# EAGLE design board_before auto router (EAGLE 5.01)

## Sheet 1 of 2
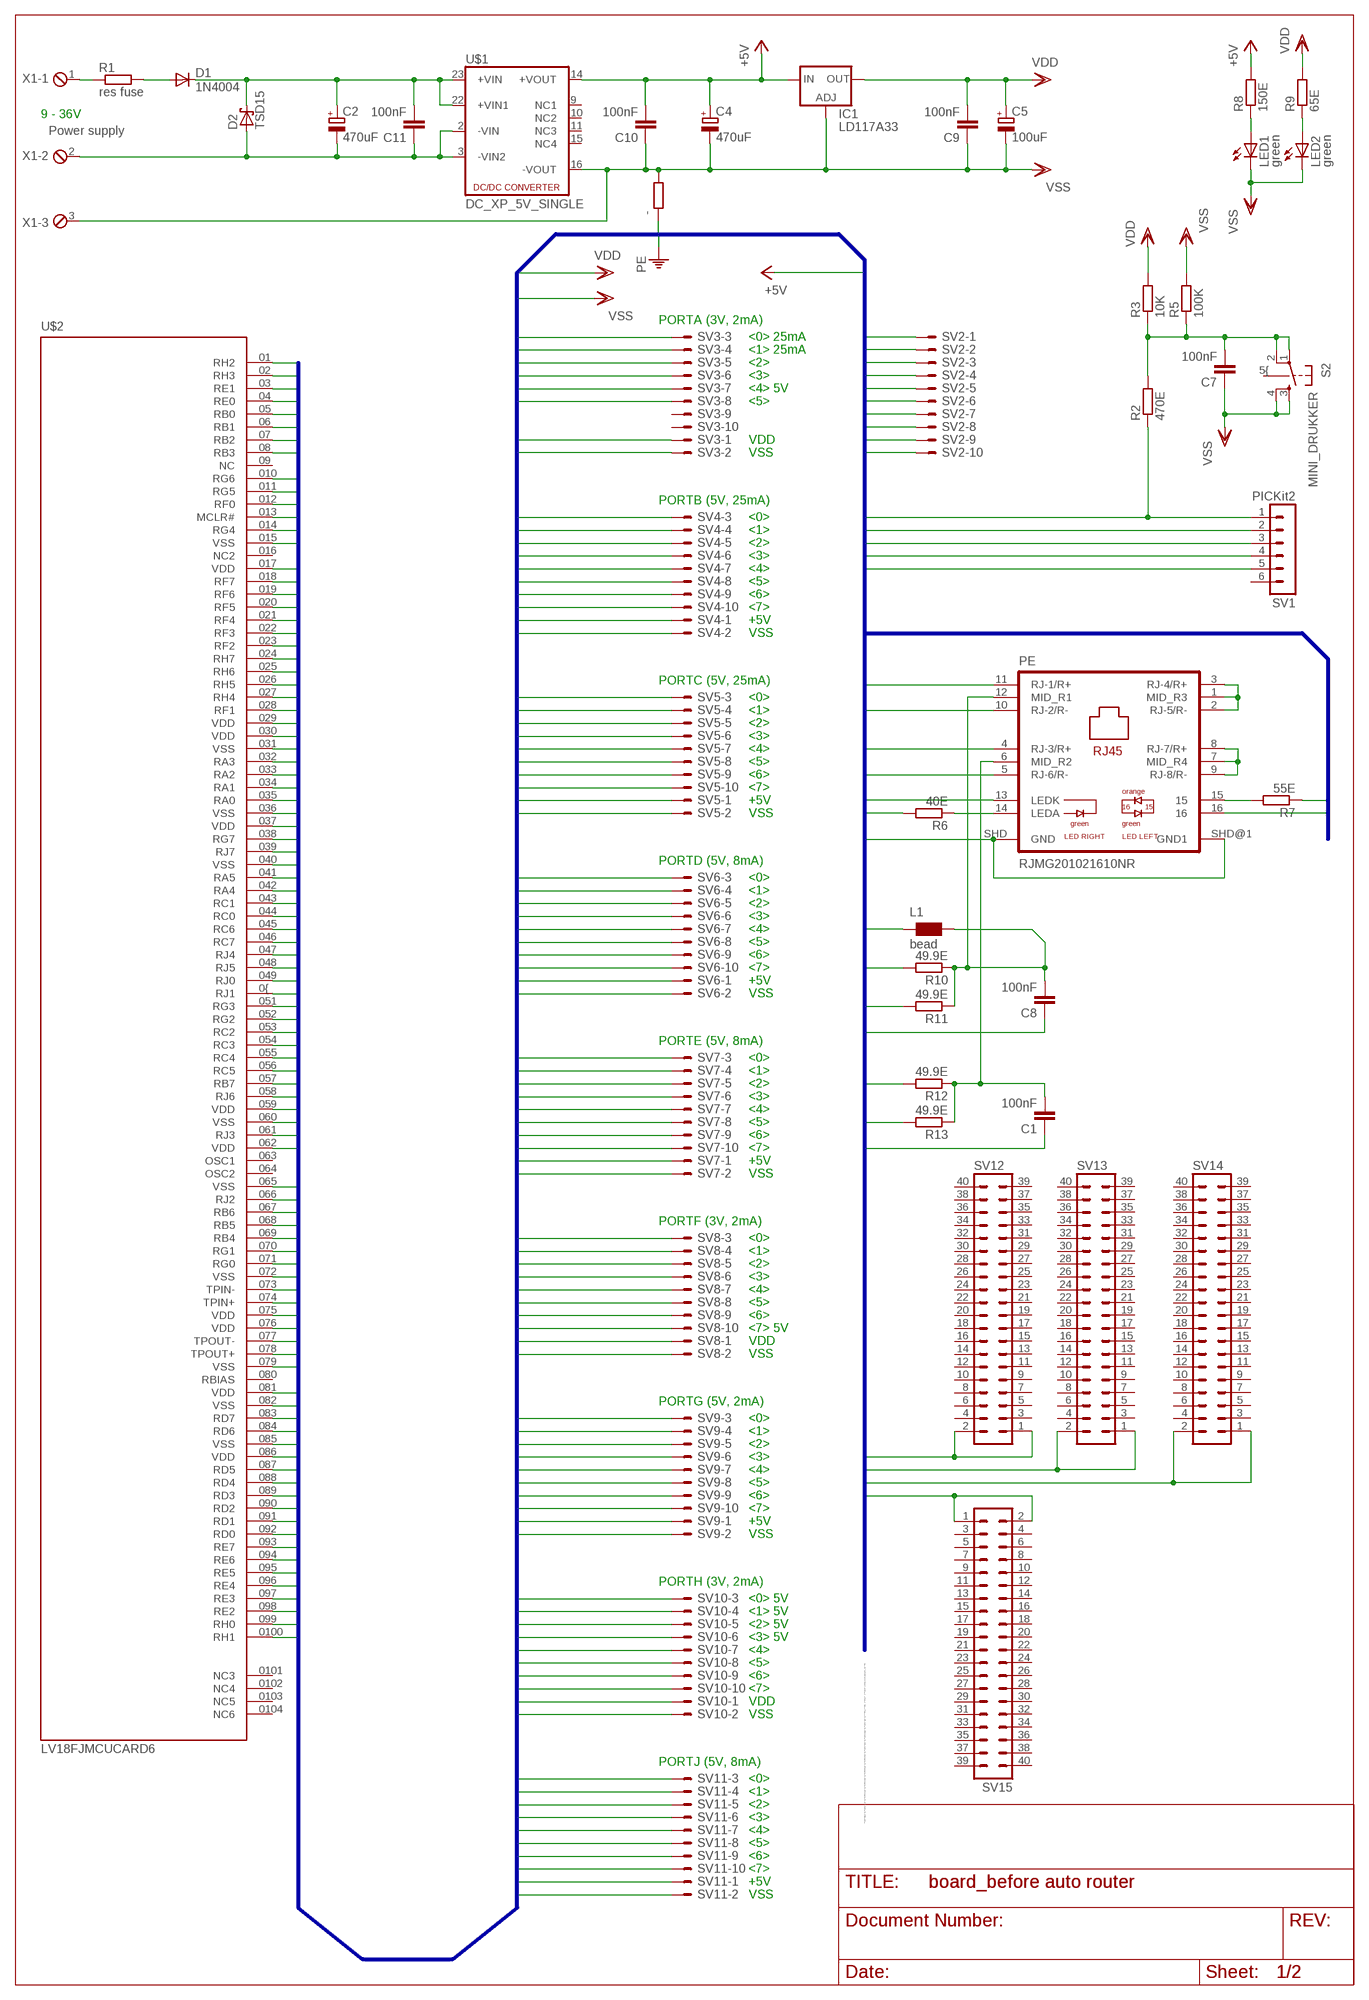
[diagram p0: schematic, sheet 1]

### Parts
-  R-EU_0204/2V  [0204V]
C1  100nF  C-EU050-025X075  [C050-025X075]
C2  470uF  CPOL-EUE5-8.5  [E5-8,5]
C4  470uF  CPOL-EUE5-8.5  [E5-8,5]
C5  100uF  CPOL-EUE5-8.5  [E5-8,5]
C7  100nF  C-EU050-025X075  [C050-025X075]
C8  100nF  C-EU050-025X075  [C050-025X075]
C9  100nF  C-EU050-025X075  [C050-025X075]
C10  100nF  C-EU050-025X075  [C050-025X075]
C11  100nF  C-EU050-025X075  [C050-025X075]
D1  1N4004  [DO41-10]
D2  TSD15  [CB429-15]
IC1  LD117A33  [TO220L1_2]
L1  bead  WE-MI_1206  [1206]
LED1  green  LED3MM  [LED3MM]
LED2  green  LED3MM  [LED3MM]
PE  RJMG201021610NR  [RJMG20102XX10XX]
R1  res fuse  R-EU_0207/7  [0207/7]
R2  470E  R-EU_0207/10  [0207/10]
R3  10K  R-EU_0207/10  [0207/10]
R5  100K  R-EU_0207/10  [0207/10]
R6  40E  R-EU_0207/10  [0207/10]
R7  55E  R-EU_0207/10  [0207/10]
R8  150E  R-EU_0207/10  [0207/10]
R9  65E  R-EU_0207/10  [0207/10]
R10  49.9E  R-EU_0207/10  [0207/10]
R11  49.9E  R-EU_0207/10  [0207/10]
R12  49.9E  R-EU_0207/10  [0207/10]
R13  49.9E  R-EU_0207/10  [0207/10]
S2  MINI_DRUKKER  [MINI_DRUKKER]
SV1  PICKit2  MA06-1  [MA06-1]
SV2  ML10E  [ML10]
SV3  ML10E  [ML10]
SV4  ML10E  [ML10]
SV5  ML10E  [ML10]
SV6  ML10E  [ML10]
SV7  ML10E  [ML10]
SV8  ML10E  [ML10]
SV9  ML10E  [ML10]
SV10  ML10E  [ML10]
SV11  ML10E  [ML10]
SV12  MA20-2  [MA20-2]
SV13  MA20-2  [MA20-2]
SV14  MA20-2  [MA20-2]
SV15  MA20-2  [MA20-2]
U$1  DC_XP_5V_SINGLE  [XP_24P_DIP_5V_SINGLE]
U$2  LV18FJMCUCARD6  [LV18FJMCUCARD6]
X1  Power supply  MPT3  [3POL254]

### Nets
+5V [Power 5V +]: C4.+ C10.2 IC1.3(IN) R8.2 SV2.1 SV2.3 SV2.5 SV4.1 SV5.1 SV6.1 SV7.1 SV9.1 SV11.1 SV14.1 SV14.2 U$1.14(+VOUT)
MCLR: R2.1 SV1.1 U$2.013(MCLR#)
N$1 [High Voltage +]: D1.A R1.2
N$2: PE.1(MID_R3) PE.2(RJ-5/R-) PE.3(RJ-4/R+)
N$3 [High Voltage +]: R1.1 X1.1
N$4 [High Voltage +]: C2.+ C11.2 D1.C D2.C U$1.22(+VIN1) U$1.23(+VIN)
N$5: C7.2 R2.2 R3.1 R5.1 S2.1(P) S2.2(P1)
N$6: PE.7(MID_R4) PE.8(RJ-7/R+) PE.9(RJ-8/R-)
N$7 [High Voltage -]: C2.- C11.1 D2.A U$1.2(-VIN) U$1.3(-VIN2) X1.2
N$8: PE.14(LEDA) R6.1
N$9: PE.15 R7.2
N$12: LED1.A R8.1
N$13: LED2.A R9.1
N$14: C8.2 L1.2 PE.12(MID_R1) R10.1 R11.1
N$15: C1.2 PE.6(MID_R2) R12.1 R13.1
PE [High Voltage -]: -.1 C1.1 C8.1 PE.SHD(GND) PE.SHD@1(GND1)
PORTA0: R6.2 SV3.3 U$2.035(RA0)
PORTA1: R7.1 SV3.4 U$2.034(RA1)
PORTA2: SV3.5 U$2.033(RA2)
PORTA3: SV3.6 U$2.032(RA3)
PORTA4: SV3.7 U$2.042(RA4)
PORTA5: SV3.8 U$2.041(RA5)
PORTB0: SV4.3 U$2.05(RB0)
PORTB1: SV4.4 U$2.06(RB1)
PORTB2: SV4.5 U$2.07(RB2)
PORTB3: SV4.6 U$2.08(RB3)
PORTB4: SV4.7 U$2.069(RB4)
PORTB5: SV4.8 U$2.068(RB5)
PORTB6: SV1.5 SV4.9 U$2.067(RB6)
PORTB7: SV1.4 SV4.10 U$2.057(RB7)
PORTC0: SV5.3 U$2.044(RC0)
PORTC1: SV5.4 U$2.043(RC1)
PORTC2: SV5.5 U$2.053(RC2)
PORTC3: SV5.6 U$2.054(RC3)
PORTC4: SV5.7 U$2.055(RC4)
PORTC5: SV5.8 U$2.056(RC5)
PORTC6: SV5.9 U$2.045(RC6)
PORTC7: SV5.10 U$2.046(RC7)
PORTD0: SV6.3 U$2.092(RD0)
PORTD1: SV6.4 U$2.091(RD1)
PORTD2: SV6.5 U$2.090(RD2)
PORTD3: SV6.6 U$2.089(RD3)
PORTD4: SV6.7 U$2.088(RD4)
PORTD5: SV6.8 U$2.087(RD5)
PORTD6: SV6.9 U$2.084(RD6)
PORTD7: SV6.10 U$2.083(RD7)
PORTE0: SV7.3 U$2.04(RE0)
PORTE1: SV7.4 U$2.03(RE1)
PORTE2: SV7.5 U$2.098(RE2)
PORTE3: SV7.6 U$2.097(RE3)
PORTE4: SV7.7 U$2.096(RE4)
PORTE5: SV7.8 U$2.095(RE5)
PORTE6: SV7.9 U$2.094(RE6)
PORTE7: SV7.10 U$2.093(RE7)
PORTF0: SV8.3 U$2.012(RF0)
PORTF1: SV8.4 U$2.028(RF1)
PORTF2: SV8.5 U$2.023(RF2)
PORTF3: SV8.6 U$2.022(RF3)
PORTF4: SV8.7 U$2.021(RF4)
PORTF5: SV8.8 U$2.020(RF5)
PORTF6: SV8.9 U$2.019(RF6)
PORTF7: SV8.10 U$2.018(RF7)
PORTG0: SV9.3 U$2.071(RG0)
PORTG1: SV9.4 U$2.070(RG1)
PORTG2: SV9.5 U$2.052(RG2)
PORTG3: SV9.6 U$2.051(RG3)
PORTG4: SV9.7 U$2.014(RG4)
PORTG5: SV9.8 U$2.011(RG5)
PORTG6: SV9.9 U$2.010(RG6)
PORTG7: SV9.10 U$2.038(RG7)
PORTH0: SV10.3 U$2.099(RH0)
PORTH1: SV10.4 U$2.0100(RH1)
PORTH2: SV10.5 U$2.01(RH2)
PORTH3: SV10.6 U$2.02(RH3)
PORTH4: SV10.7 U$2.027(RH4)
PORTH5: SV10.8 U$2.026(RH5)
PORTH6: SV10.9 U$2.025(RH6)
PORTH7: SV10.10 U$2.024(RH7)
PORTJ0: SV11.3 U$2.049(RJ0)
PORTJ1: SV11.4 U$2.0{(RJ1)
PORTJ2: SV11.5 U$2.066(RJ2)
PORTJ3: SV11.6 U$2.061(RJ3)
PORTJ4: SV11.7 U$2.047(RJ4)
PORTJ5: SV11.8 U$2.048(RJ5)
PORTJ6: SV11.9 U$2.058(RJ6)
PORTJ7: SV11.10 U$2.039(RJ7)
TPIN+: PE.4(RJ-3/R+) R12.2 U$2.074(TPIN+)
TPIN-: PE.5(RJ-6/R-) R13.2 U$2.073(TPIN-)
TPOUT+: PE.11(RJ-1/R+) R10.2 U$2.078(TPOUT+)
TPOUT-: PE.10(RJ-2/R-) R11.2 U$2.077(TPOUT-)
VDD [Power 3V +]: C5.+ C9.2 IC1.2(OUT) L1.1 R3.2 R9.2 SV1.2 SV2.7 SV2.9 SV3.1 SV8.1 SV10.1 SV12.1 SV12.2 U$2.017(VDD) U$2.029(VDD) U$2.030(VDD) U$2.037(VDD) U$2.059(VDD) U$2.062(VDD) U$2.075(VDD) U$2.076(VDD) U$2.081(VDD) U$2.086(VDD)
VSS [Power 0V]: -.2 C4.- C5.- C7.1 C9.1 C10.1 IC1.1(ADJ) LED1.K(C) LED2.K(C) PE.13(LEDK) PE.16 R5.2 S2.3(S) S2.4(S1) SV1.3 SV2.2 SV2.4 SV2.6 SV2.8 SV2.10 SV3.2 SV4.2 SV5.2 SV6.2 SV7.2 SV8.2 SV9.2 SV10.2 SV11.2 SV13.1 SV13.2 SV15.1 SV15.2 U$1.16(-VOUT) U$2.015(VSS) U$2.031(VSS) U$2.036(VSS) U$2.040(VSS) U$2.060(VSS) U$2.065(VSS) U$2.072(VSS) U$2.079(VSS) U$2.082(VSS) U$2.085(VSS) X1.3
Unconnected: S2.5{(SHLD) SV1.6 SV3.9 SV3.10 SV12.3 SV12.4 SV12.5 SV12.6 SV12.7 SV12.8 SV12.9 SV12.10 SV12.11 SV12.12 SV12.13 SV12.14 SV12.15 SV12.16 SV12.17 SV12.18 SV12.19 SV12.20 SV12.21 SV12.22 SV12.23 SV12.24 SV12.25 SV12.26 SV12.27 SV12.28 SV12.29 SV12.30 SV12.31 SV12.32 SV12.33 SV12.34 SV12.35 SV12.36 SV12.37 SV12.38 SV12.39 SV12.40 SV13.3 SV13.4 SV13.5 SV13.6 SV13.7 SV13.8 SV13.9 SV13.10 SV13.11 SV13.12 SV13.13 SV13.14 SV13.15 SV13.16 SV13.17 SV13.18 SV13.19 SV13.20 SV13.21 SV13.22 SV13.23 SV13.24 SV13.25 SV13.26 SV13.27 SV13.28 SV13.29 SV13.30 SV13.31 SV13.32 SV13.33 SV13.34 SV13.35 SV13.36 SV13.37 SV13.38 SV13.39 SV13.40 SV14.3 SV14.4 SV14.5 SV14.6 SV14.7 SV14.8 SV14.9 SV14.10 SV14.11 SV14.12 SV14.13 SV14.14 SV14.15 SV14.16 SV14.17 SV14.18 SV14.19 SV14.20 SV14.21 SV14.22 SV14.23 SV14.24 SV14.25 SV14.26 SV14.27 SV14.28 SV14.29 SV14.30 SV14.31 SV14.32 SV14.33 SV14.34 SV14.35 SV14.36 SV14.37 SV14.38 SV14.39 SV14.40 SV15.3 SV15.4 SV15.5 SV15.6 SV15.7 SV15.8 SV15.9 SV15.10 SV15.11 SV15.12 SV15.13 SV15.14 SV15.15 SV15.16 SV15.17 SV15.18 SV15.19 SV15.20 SV15.21 SV15.22 SV15.23 SV15.24 SV15.25 SV15.26 SV15.27 SV15.28 SV15.29 SV15.30 SV15.31 SV15.32 SV15.33 SV15.34 SV15.35 SV15.36 SV15.37 SV15.38 SV15.39 SV15.40 U$1.9(NC1) U$1.10(NC2) U$1.11(NC3) U$1.15(NC4) U$2.09(NC) U$2.016(NC2) U$2.063(OSC1) U$2.064(OSC2) U$2.080(RBIAS) U$2.0101(NC3) U$2.0102(NC4) U$2.0103(NC5) U$2.0104(NC6)

### Buses
PORTA[0..7],PORTB[0..7],PORTC[0..7],PORTD[0..7],PORTE[0..7],PORTF[0..7],PORTG[0..7],PORTH[0..7],PORTJ[0..7],TPIN+,TPIN-,TPOUT-,TPOUT+,VDD,VSS,MCLR,+5V,PE

### Notes on the sheet
- 9 - 36V
- PORTA (3V, 2mA)
- <0> 25mA
- <1> 25mA
- <2>
- <3>
- <4> 5V
- <5>
- VDD
- VSS
- PORTB (5V, 25mA)
- <0>
- <1>
- <2>
- <3>
- <4>
- <5>
- <6>
- <7>
- +5V
- VSS
- PORTC (5V, 25mA)
- <0>
- <1>
- <2>
- <3>
- <4>
- <5>
- <6>
- <7>
- +5V
- VSS
- PORTD (5V, 8mA)
- <0>
- <1>
- <2>
- <3>
- <4>
- <5>
- <6>
- <7>
- +5V
- VSS
- PORTE (5V, 8mA)
- <0>
- <1>
- <2>
- <3>
- <4>
- <5>
- <6>
- <7>
- +5V
- VSS
- PORTF (3V, 2mA)
- <0>
- <1>
- <2>
- <3>
- <4>
- <5>
- <6>
- <7> 5V
- VDD
- VSS
- PORTG (5V, 2mA)
- <0>
- <1>
- <2>
- <3>
- <4>
- <5>
- <6>
- <7>
- +5V
- VSS
- PORTH (3V, 2mA)
- <0> 5V
- <1> 5V
- <2> 5V
- <3> 5V
- <4>
- <5>
- <6>
- <7>
- VDD
- VSS
- PORTJ (5V, 8mA)
- <0>
- <1>
- <2>
- <3>
- <4>
- <5>
- <6>
- <7>
- +5V
- VSS

## Sheet 2 of 2
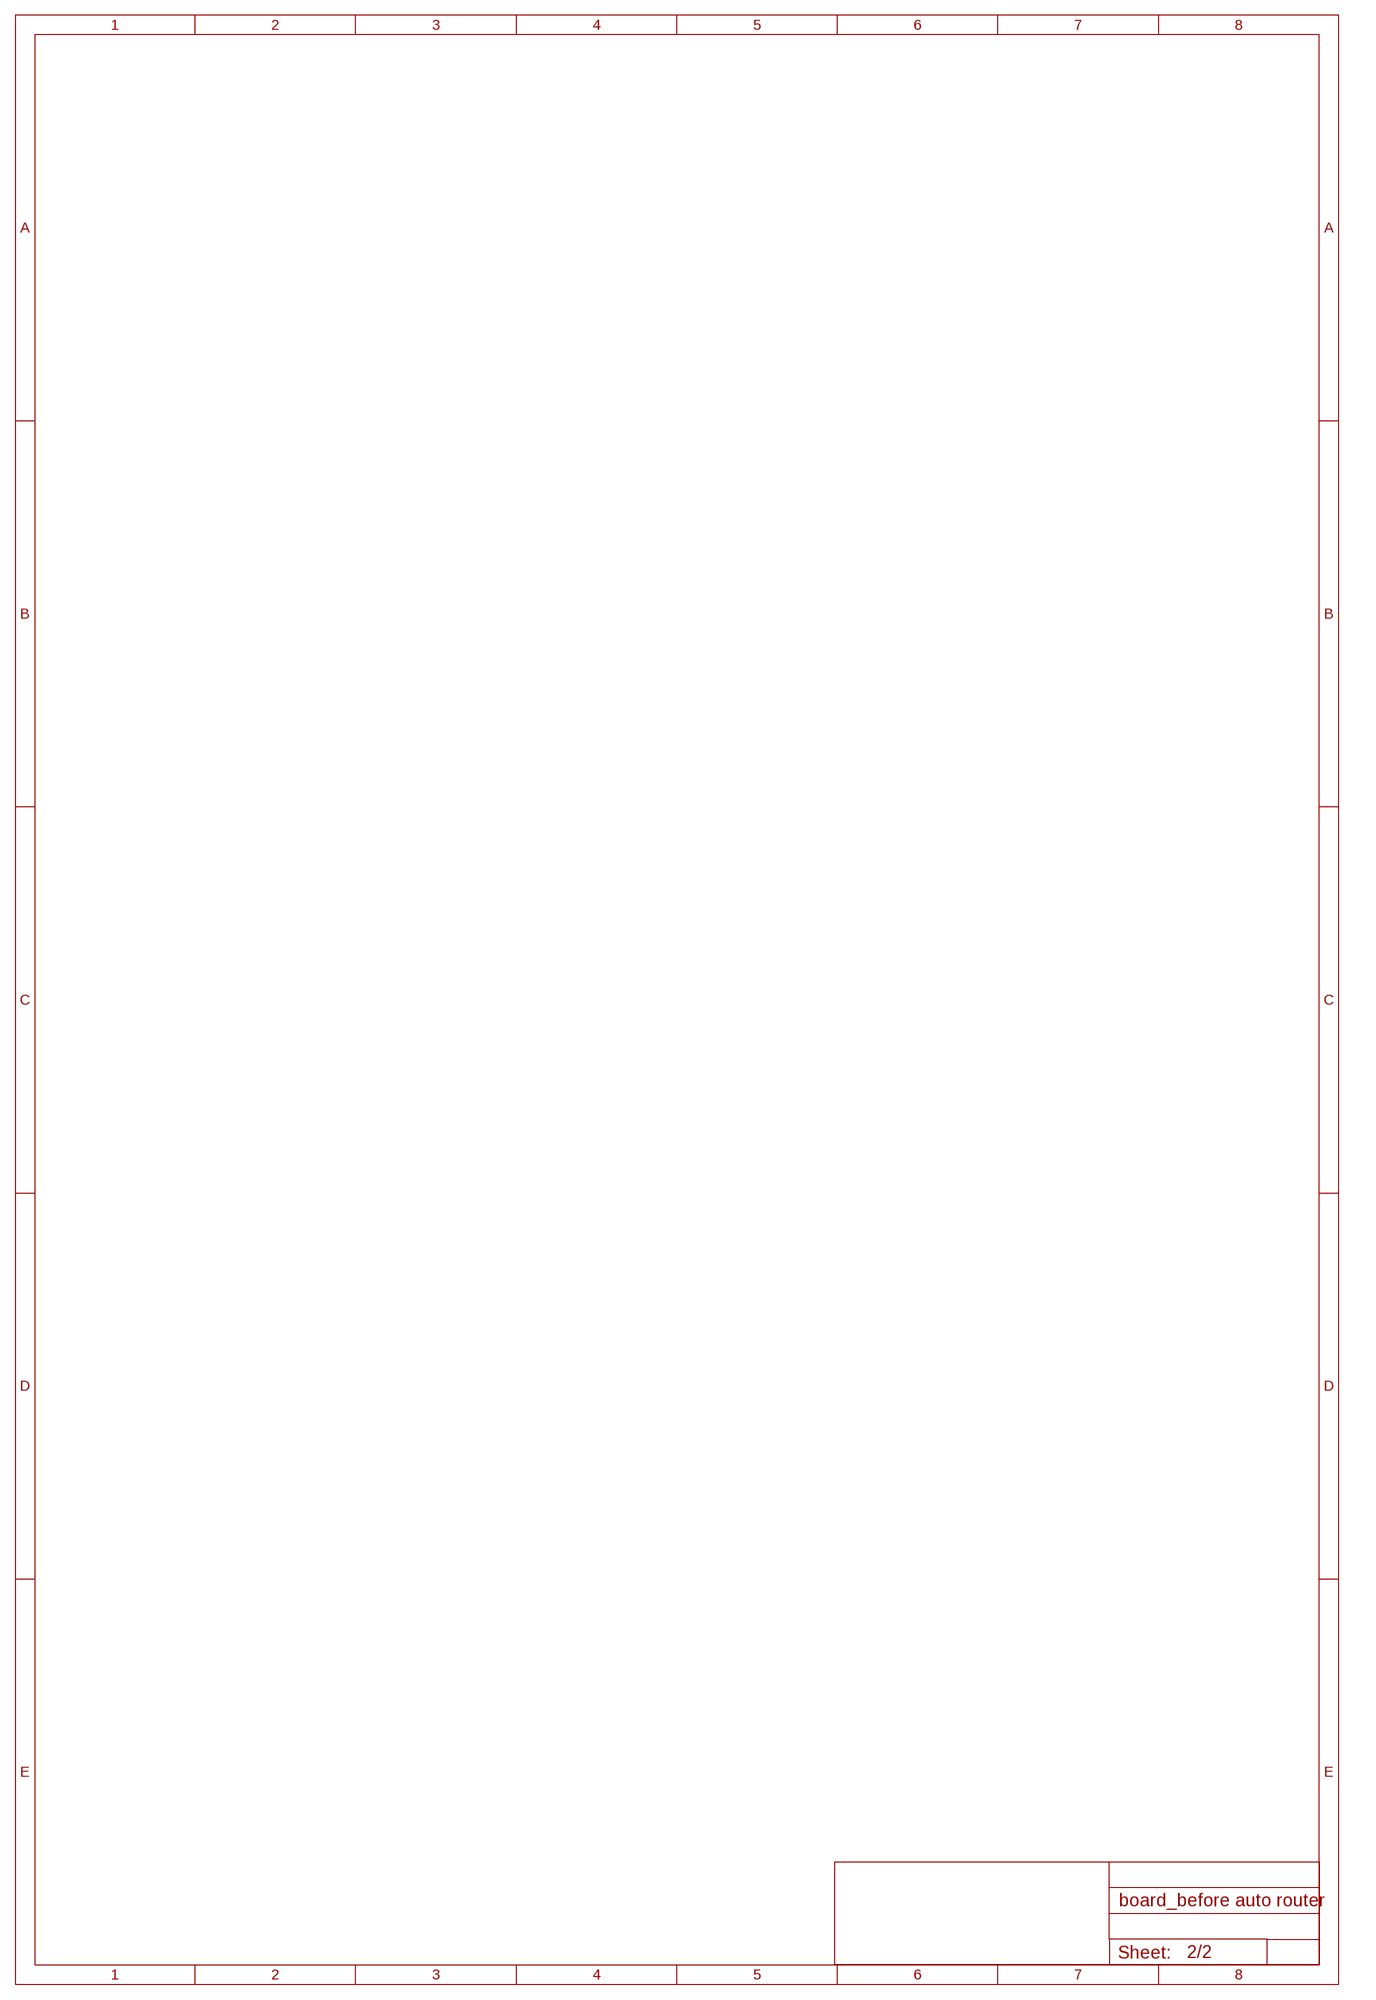
[diagram p1: schematic, sheet 2]

## Library data of the parts
- R1-R3 R5-R13 = rcl:R-EU_: RESISTOR, European symbol
C1 C7-C11 = rcl:C-EU: CAPACITOR, European symbol
C2 C4 C5 = rcl:CPOL-EU: POLARIZED CAPACITOR, European symbol
D1 = diode:1N4004: DIODE general purpose rectifier, 1 A
D2 = diode:TSD15: DIODE
IC1 = v-reg:LD117A?*: Low drop fixed and adjustable positive voltage regulators 1 A Source: http://www.st.com/stonline/products/literature/ds/7194/ld1117axx.pdf
L1 = wuerth-elektronik:WE-MI: SMD Multilayer Inductor WE-MI - Excellent solderability and high heat resistance -- Filter switches -- Oscillators -- Adjustment networks -- Discretely built T- or Pi-Filter
LED1 LED2 = led:LED: LED OSRAM: - CHIPLED LG R971, LG N971, LY N971, LG Q971, LY Q971, LO R971, LY R971 LH N974, LH R974 LS Q976, LO Q976, LY Q976 LO Q996 - Hyper CHIPLED LW Q18S LB Q993, LB Q99A, LB R99A - SideLED LS A670, LO A670, LY A670, LG A670, LP A670 LB A673, LV A673, LT A673, LW A673 LH A674 LY A675 LS A676, LA A676, LO A676, LY A676, LW A676 LS A679, LY A679, LG A679 - Hyper Micro SIDELED® LS Y876, LA Y876, LO Y876, LY Y876 LT Y87S - SmartLED LW L88C, LW L88S LB L89C, LB L89S, LG L890 LS L89K, LO L89K, LY L89K LS L896, LA L896, LO L896, LY L896 - TOPLED LS T670, LO T670, LY T670, LG T670, LP T670 LSG T670, LSP T670, LSY T670, LOP T670, LYG T670 LG T671, LOG T671, LSG T671 LB T673, LV T673, LT T673, LW T673 LH T674 LS T676, LA T676, LO T676, LY T676, LB T676, LH T676, LSB T676, LW T676 LB T67C, LV T67C, LT T67C, LS T67K, LO T67K, LY T67K, LW E67C LS E67B, LA E67B, LO E67B, LY E67B, LB E67C, LV E67C, LT E67C LW T67C LS T679, LY T679, LG T679 LS T770, LO T770, LY T770, LG T770, LP T770 LB T773, LV T773, LT T773, LW T773 LH T774 LS E675, LA E675, LY E675, LS T675 LS T776, LA T776, LO T776, LY T776, LB T776 LHGB T686 LT T68C, LB T68C - Hyper Mini TOPLED® LB M676 - Mini TOPLED Santana® LG M470 LS M47K, LO M47K, LY M47K Source: http://www.osram.convergy.de LUXEON: - LUMILED® LXK2-PW12-R00, LXK2-PW12-S00, LXK2-PW14-U00, LXK2-PW14-V00 LXK2-PM12-R00, LXK2-PM12-S00, LXK2-PM14-U00 LXK2-PE12-Q00, LXK2-PE12-R00, LXK2-PE12-S00, LXK2-PE14-T00, LXK2-PE14-U00 LXK2-PB12-K00, LXK2-PB12-L00, LXK2-PB12-M00, LXK2-PB14-N00, LXK2-PB14-P00, LXK2-PB14-Q00 LXK2-PR12-L00, LXK2-PR12-M00, LXK2-PR14-Q00, LXK2-PR14-R00 LXK2-PD12-Q00, LXK2-PD12-R00, LXK2-PD12-S00 LXK2-PH12-R00, LXK2-PH12-S00 LXK2-PL12-P00, LXK2-PL12-Q00, LXK2-PL12-R00 Source: www.luxeon.com KINGBRIGHT: KA-3528ASYC Source: www.kingbright.com
PE = Custom components:RJMG201021610NR
S2 = Custom components:MINI_DRUKKER
SV1 = con-lstb:MA06-1: PIN HEADER
SV2-SV11 = con-ml:ML10E: HARTING
SV12-SV15 = con-lstb:MA20-2: PIN HEADER
U$1 = dc-dc-converter:DC_XP_5V_SINGLE
U$2 = Mikroe:LV18FJMCUCARD6
X1 = con-phoenix-254:MPT3: PHOENIX CONNECTOR

## Net classes
1 Power 5V +: width 0.762 mm, drill 0.381 mm, clearance 0.762 mm
2 High Voltage +: width 1.27 mm, drill 0.635 mm, clearance 1.27 mm
3 Digital: width 0.406 mm, drill 0.508 mm, clearance 0.406 mm
4 Power 0V: width 0.762 mm, drill 0.381 mm, clearance 0.762 mm
5 High Voltage -: width 1.27 mm, drill 0.635 mm, clearance 1.27 mm
6 Power 3V +: width 1.016 mm, drill 0.61 mm, clearance 0.61 mm

## Board
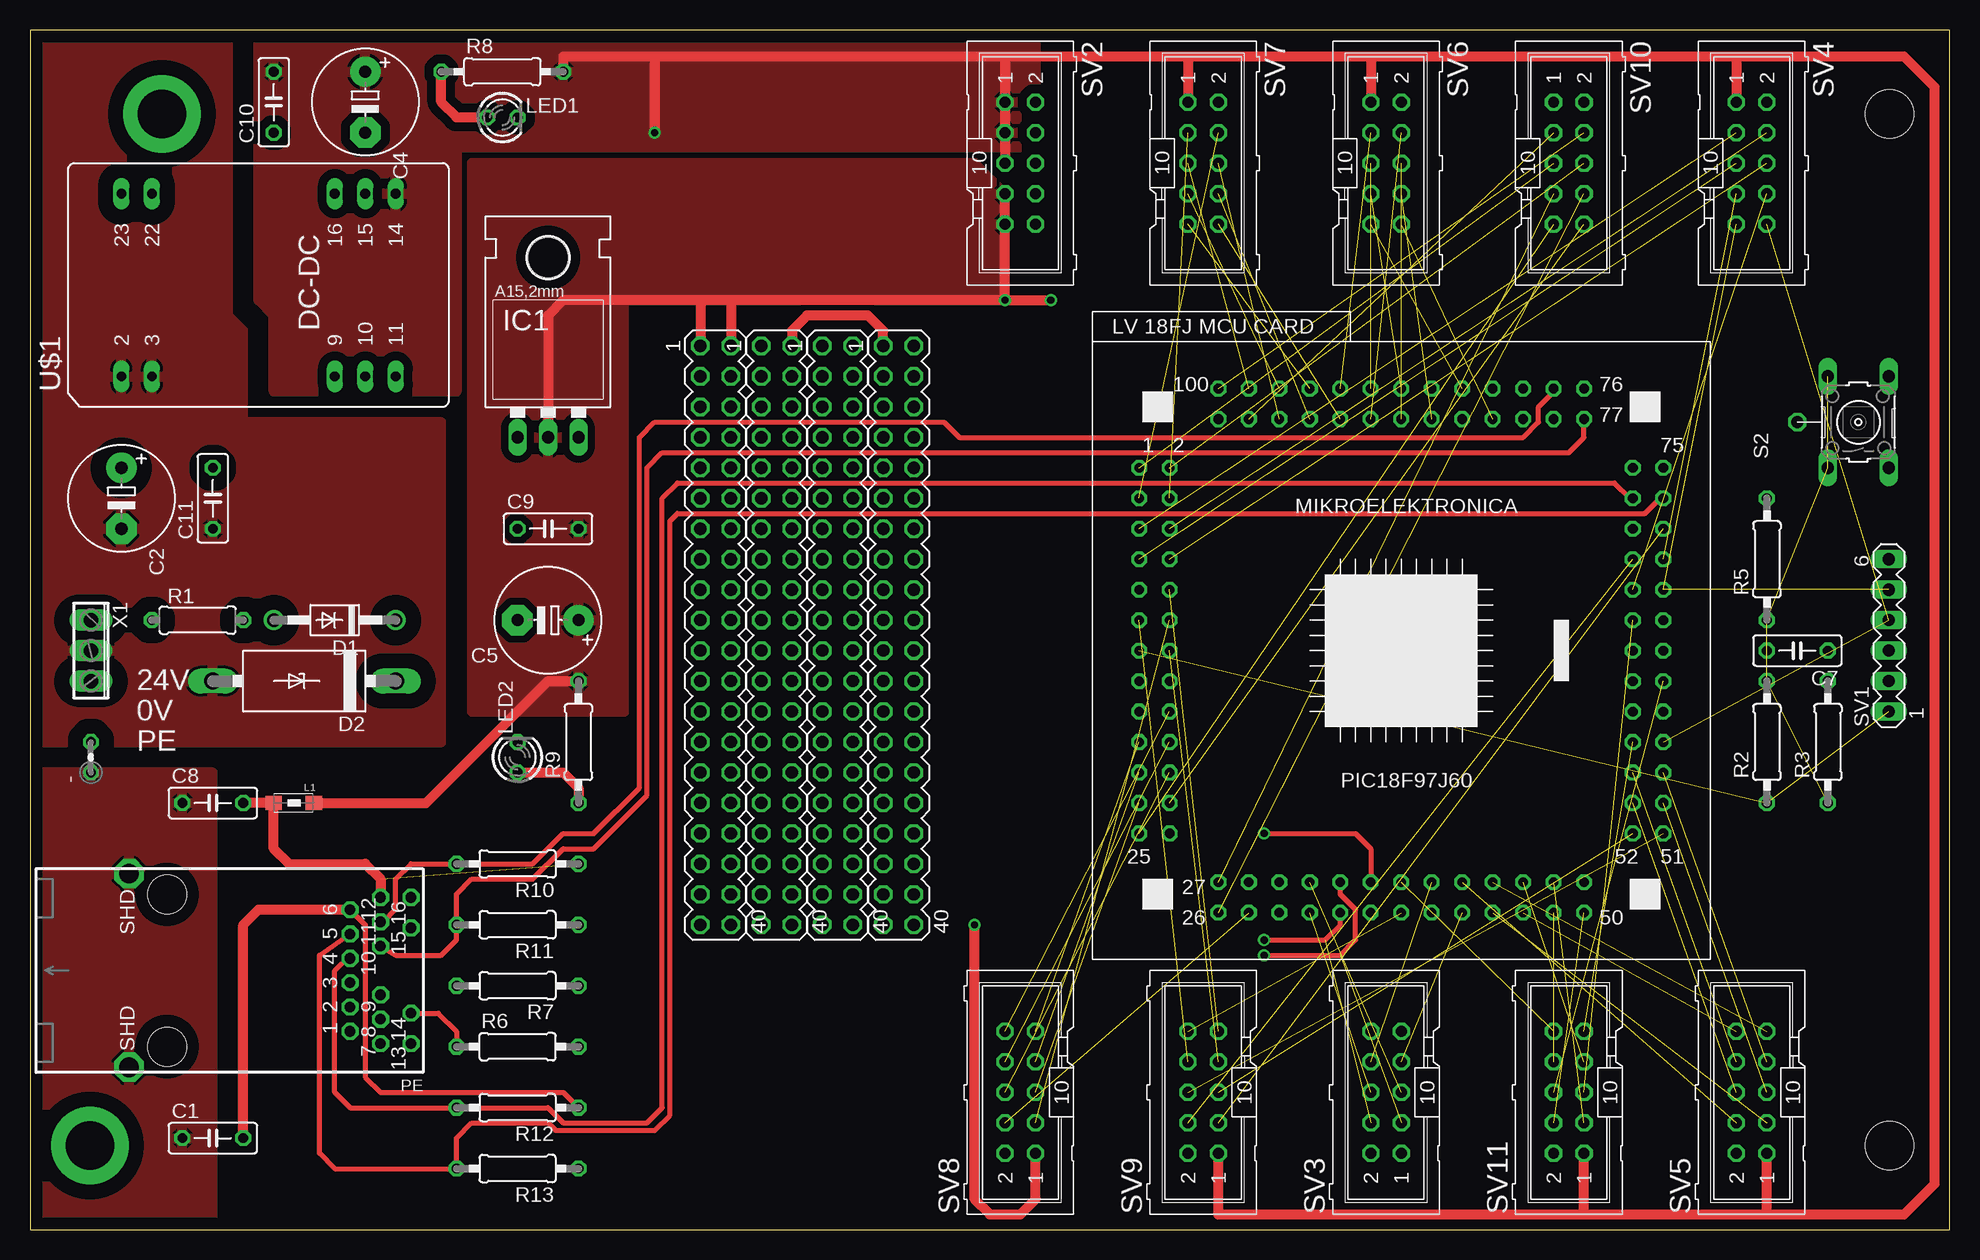
[diagram p2: board, top side]
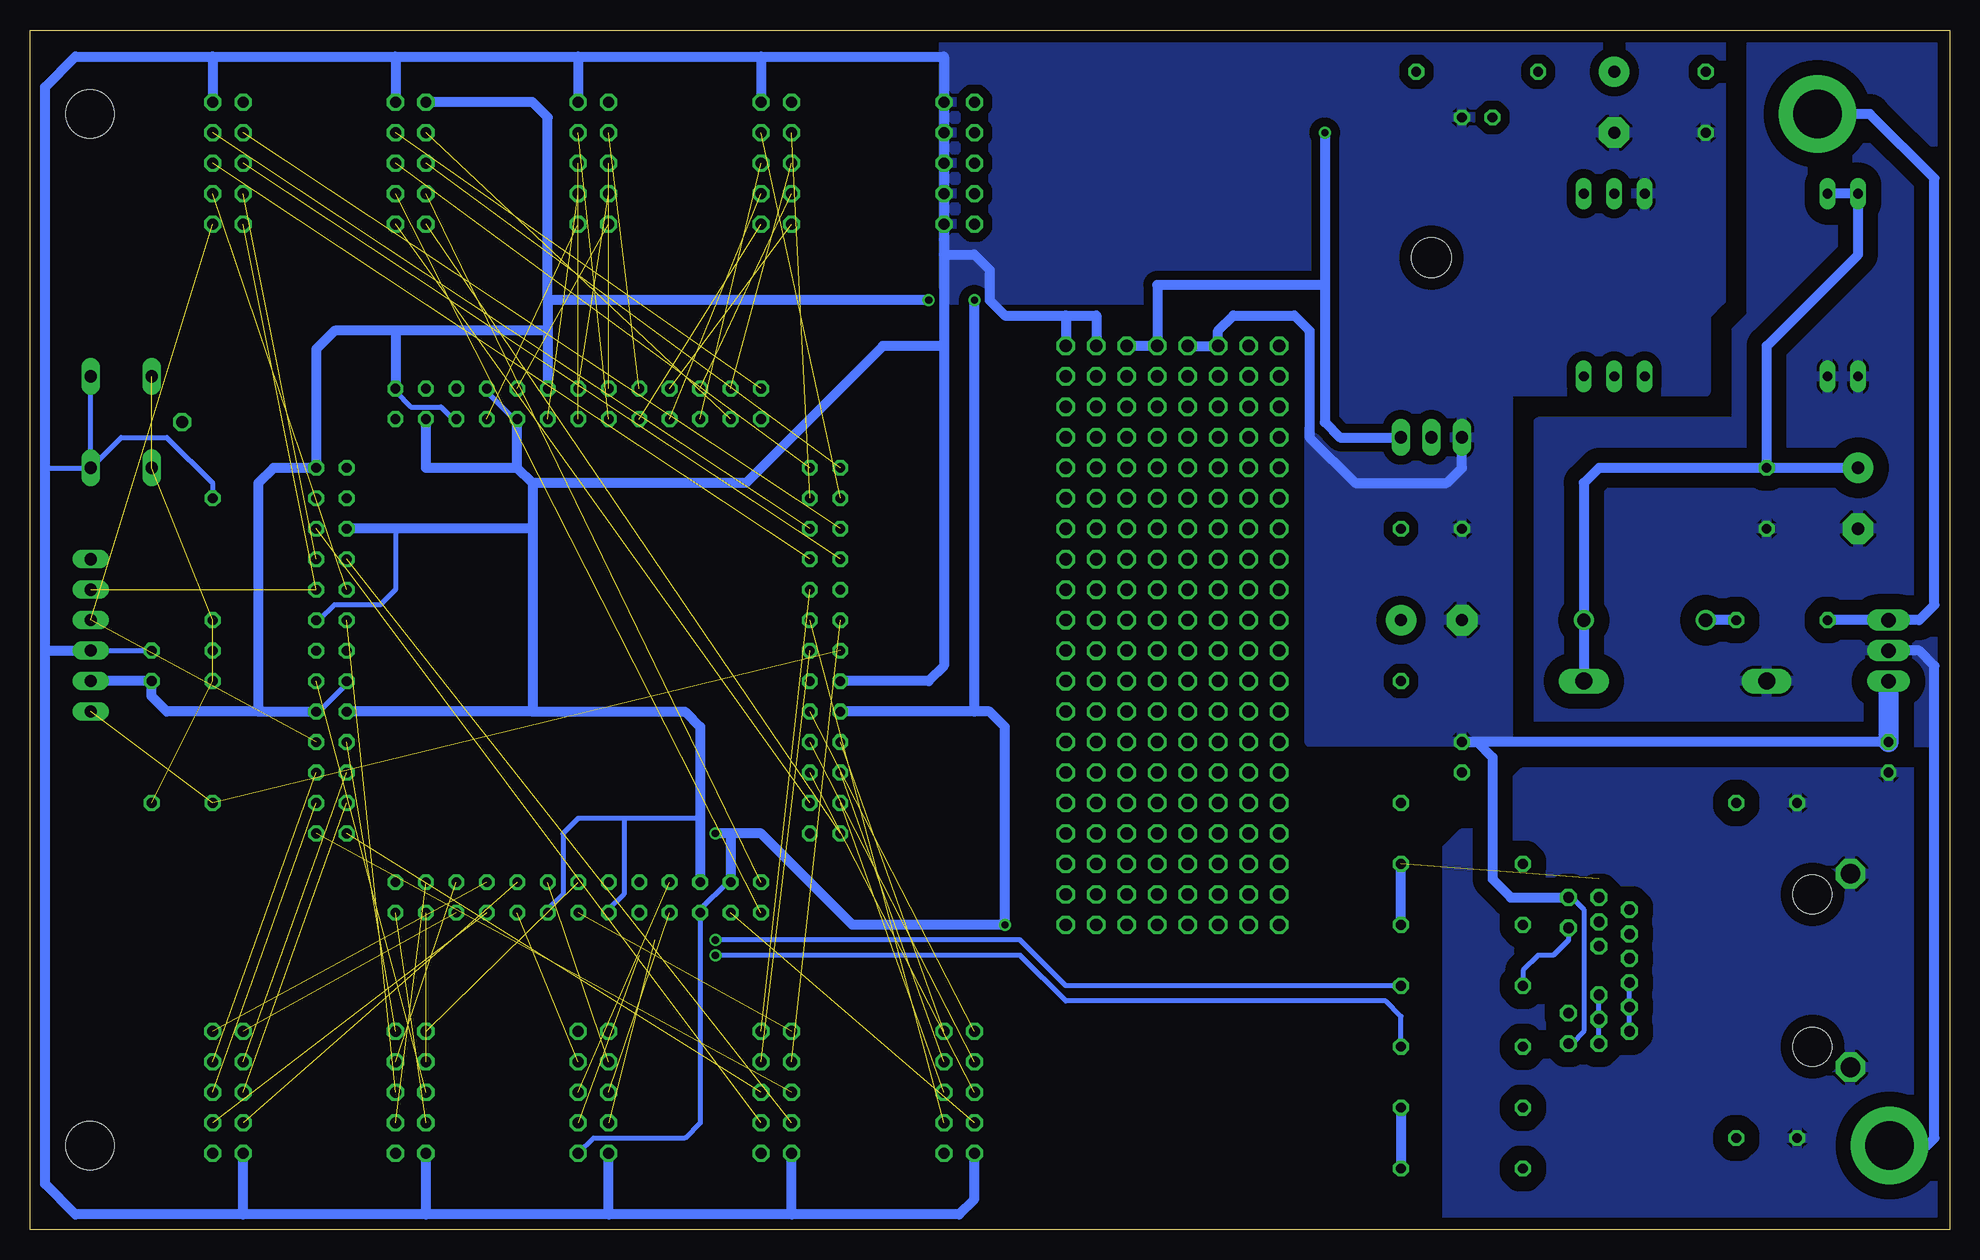
[diagram p3: board, bottom side, seen from below]

Size 160 x 100 mm. Coordinates in mm from the lower left corner, seen from the top.
Outline: 0,0 160,0 160,100 0,100 0,0
Copper layers (1*16): Top 0.035mm / dielectric 1.5mm / Bottom 0.035mm
Design rules "Make-PCB-Dual-Layer": minimum track width 8mil, minimum drill 12mil, track to track 8mil, track to pad 8mil, pad to pad 8mil, via to via 8mil, smd to smd 8mil, copper to edge 40mil, drill to drill 8mil, minimum pad ring 10mil, minimum via ring 8mil, stop-mask expansion 4mil, vias tented up to drill 0mil, thermal gap 10mil
Holes 4 mm at 155,7 155,93

### Footprints (pad centres in the part's own frame; a part is rotated, then mirrored left to right if it is on the bottom)
0204V = drill 0.813 octagon: 1 -1.27,0; 2 1.27,0
C050-025X075 = drill 0.813 octagon: 1 -2.54,0; 2 2.54,0
E5-8,5 = drill 1.016 pad 2.54 round: + -2.54,0 | drill 1.016 pad 2.54 octagon: - 2.54,0
DO41-10 = drill 1.118 round: A 5.08,0; C -5.08,0
CB429-15 = drill 1.397 long: A 7.62,0; C -7.62,0
TO220L1_2 = drill 1.016 long: 1 -2.54,-3.81; 2 0,-3.81; 3 2.54,-3.81 | hole 3.302: 0,11.176
1206 = smd 1.35 x 1.2: 1 -1.7,0; 2 1.65,0
LED3MM = drill 0.813 octagon: A -1.27,0; K 1.27,0
RJMG20102XX10XX = drill 0.89 octagon: 1 -5.075,-15.25; 2 -3.045,-15.25; 3 -1.015,-15.25; 4 1.015,-15.25; 5 3.045,-15.25; 6 5.075,-15.25; 7 -6.09,-17.79; 8 -4.06,-17.79; 9 -2.03,-17.79; 10 2.03,-17.79; 11 4.06,-17.79; 12 6.09,-17.79; 13 -6.09,-20.33; 14 -3.55,-20.33; 15 3.55,-20.33; 16 6.09,-20.33 | drill 1.64 octagon: SHD -8.065,3.17; SHD@1 8.065,3.17 | hole 3.25: -6.35,0; 6.35,0
0207/7 = drill 0.813 octagon: 1 -3.81,0; 2 3.81,0
0207/10 = drill 0.813 octagon: 1 -5.08,0; 2 5.08,0
MINI_DRUKKER = drill 1.016 long: 1 -3.81,2.54; 2 3.81,2.54; 3 -3.81,-2.54; 4 3.81,-2.54 | drill 1.016 octagon: 5{ 0,5.08
MA06-1 = drill 1.016 long: 1 -6.35,0; 2 -3.81,0; 3 -1.27,0; 4 1.27,0; 5 3.81,0; 6 6.35,0
ML10 = drill 0.914 octagon: 1 -5.08,-1.27; 2 -5.08,1.27; 3 -2.54,-1.27; 4 -2.54,1.27; 5 0,-1.27; 6 0,1.27; 7 2.54,-1.27; 8 2.54,1.27; 9 5.08,-1.27; 10 5.08,1.27
MA20-2 = drill 1.016 octagon: 1 -24.13,-1.27; 2 -24.13,1.27; 3 -21.59,-1.27; 4 -21.59,1.27; 5 -19.05,-1.27; 6 -19.05,1.27; 7 -16.51,-1.27; 8 -16.51,1.27; 9 -13.97,-1.27; 10 -13.97,1.27; 11 -11.43,-1.27; 12 -11.43,1.27; 13 -8.89,-1.27; 14 -8.89,1.27; 15 -6.35,-1.27; 16 -6.35,1.27; 17 -3.81,-1.27; 18 -3.81,1.27; 19 -1.27,-1.27; 20 -1.27,1.27; 21 1.27,-1.27; 22 1.27,1.27; 23 3.81,-1.27; 24 3.81,1.27; 25 6.35,-1.27; 26 6.35,1.27; 27 8.89,-1.27; 28 8.89,1.27; 29 11.43,-1.27; 30 11.43,1.27; 31 13.97,-1.27; 32 13.97,1.27; 33 16.51,-1.27; 34 16.51,1.27; 35 19.05,-1.27; 36 19.05,1.27; 37 21.59,-1.27; 38 21.59,1.27; 39 24.13,-1.27; 40 24.13,1.27
XP_24P_DIP_5V_SINGLE = drill 0.813 long: 2 -7.62,11.43; 3 -7.62,8.89; 9 -7.62,-6.35; 10 -7.62,-8.89; 11 -7.62,-11.43; 14 7.62,-11.43; 15 7.62,-8.89; 16 7.62,-6.35; 22 7.62,8.89; 23 7.62,11.43
LV18FJMCUCARD6 = drill 0.8 octagon: 0{ 15.24,-21.844; 01 -21.844,15.24; 02 -19.304,15.24; 03 -21.844,12.7; 04 -19.304,12.7; 05 -21.844,10.16; 06 -19.304,10.16; 07 -21.844,7.62; 08 -19.304,7.62; 09 -21.844,5.08; 010 -19.304,5.08; 011 -21.844,2.54; 012 -19.304,2.54; 013 -21.844,0; 014 -19.304,0; 015 -21.844,-2.54; 016 -19.304,-2.54; 017 -21.844,-5.08; 018 -19.304,-5.08; 019 -21.844,-7.62; 020 -19.304,-7.62; 021 -21.844,-10.16; 022 -19.304,-10.16; 023 -21.844,-12.7; 024 -19.304,-12.7; 025 -21.844,-15.24; 026 -15.24,-21.844; 027 -15.24,-19.304; 028 -12.7,-21.844; 029 -12.7,-19.304; 030 -10.16,-21.844; 031 -10.16,-19.304; 032 -7.62,-21.844; 033 -7.62,-19.304; 034 -5.08,-21.844; 035 -5.08,-19.304; 036 -2.54,-21.844; 037 -2.54,-19.304; 038 0,-21.844; 039 0,-19.304; 040 2.54,-21.844; 041 2.54,-19.304; 042 5.08,-21.844; 043 5.08,-19.304; 044 7.62,-21.844; 045 7.62,-19.304; 046 10.16,-21.844; 047 10.16,-19.304; 048 12.7,-21.844; 049 12.7,-19.304; 051 21.844,-15.24; 052 19.304,-15.24; 053 21.844,-12.7; 054 19.304,-12.7; 055 21.844,-10.16; 056 19.304,-10.16; 057 21.844,-7.62; 058 19.304,-7.62; 059 21.844,-5.08; 060 19.304,-5.08; 061 21.844,-2.54; 062 19.304,-2.54; 063 21.844,0; 064 19.304,0; 065 21.844,2.54; 066 19.304,2.54; 067 21.844,5.08; 068 19.304,5.08; 069 21.844,7.62; 070 19.304,7.62; 071 21.844,10.16; 072 19.304,10.16; 073 21.844,12.7; 074 19.304,12.7; 075 21.844,15.24; 076 15.24,21.844; 077 15.24,19.304; 078 12.7,21.844; 079 12.7,19.304; 080 10.16,21.844; 081 10.16,19.304; 082 7.62,21.844; 083 7.62,19.304; 084 5.08,21.844; 085 5.08,19.304; 086 2.54,21.844; 087 2.54,19.304; 088 0,21.844; 089 0,19.304; 090 -2.54,21.844; 091 -2.54,19.304; 092 -5.08,21.844; 093 -5.08,19.304; 094 -7.62,21.844; 095 -7.62,19.304; 096 -10.16,21.844; 097 -10.16,19.304; 098 -12.7,21.844; 099 -12.7,19.304; 0100 -15.24,21.844; 0101 -19.304,-15.24; 0102 15.24,-19.304; 0103 19.304,15.24; 0104 -15.24,19.304
3POL254 = drill 1.2 long: 1 -2.54,0; 2 0,0; 3 2.54,0

### Placement (x,y rotation side)
-  5.08,39.37 90 top
C1  15.24,7.62 0 top
C2  7.62,60.96 270 top
C4  27.94,93.98 270 top
C5  43.18,50.8 180 top
C7  147.32,48.26 180 top
C8  15.24,35.56 0 top
C9  43.18,58.42 0 top
C10  20.32,93.98 90 top
C11  15.24,60.96 90 top
D1  25.4,50.8 180 top
D2  22.86,45.72 180 top
IC1  43.18,69.85 0 top
L1  21.97,35.56 180 top
LED1  39.37,92.71 0 top
LED2  40.64,39.37 90 top
PE  11.43,21.59 90 top
R1  13.97,50.8 0 top
R2  144.78,40.64 90 top
R3  149.86,40.64 90 top
R5  144.78,55.88 90 top
R6  40.64,15.24 0 top
R7  40.64,20.32 180 top
R8  39.37,96.52 0 top
R9  45.72,40.64 90 top
R10  40.64,30.48 180 top
R11  40.64,25.4 180 top
R12  40.64,10.16 180 top
R13  40.64,5.08 180 top
S2  152.4,67.31 90 top
SV1  154.94,49.53 90 top
SV2  82.55,88.9 270 top
SV3  113.03,11.43 90 top
SV4  143.51,88.9 270 top
SV5  143.51,11.43 90 top
SV6  113.03,88.9 270 top
SV7  97.79,88.9 270 top
SV8  82.55,11.43 90 top
SV9  97.79,11.43 90 top
SV10  128.27,88.9 270 top
SV11  128.27,11.43 90 top
SV12  57.15,49.53 270 top
SV13  62.23,49.53 270 top
SV14  67.31,49.53 270 top
SV15  72.39,49.53 270 top
U$1  19.05,78.74 90 top
U$2  114.3,48.26 0 top
X1  5.08,48.26 270 top

### Tracks (layer width: path | path; a pad name or v marks a point on that pad's centre or on a via)
+5V  (via drill 0.6)
  Top 0.813: 81.28,97.79 52.07,97.79 | 52.07,97.79 44.45,97.79 R8.2 | SV2.5 SV2.3 SV2.1 81.28,97.79 | 96.52,97.79 SV7.1 | 96.52,97.79 81.28,97.79 | 111.76,97.79 SV6.1 | 111.76,97.79 96.52,97.79 | 142.24,97.79 111.76,97.79 | 144.78,1.27 156.21,1.27 158.75,3.81 158.75,95.25 156.21,97.79 142.24,97.79 | 144.78,1.27 SV5.1 | 142.24,97.79 SV4.1 | 129.54,1.27 SV11.1 | 129.54,1.27 144.78,1.27 | SV9.1 99.06,1.27 129.54,1.27 | 52.07,97.79 v52.07,91.44
  Bottom 0.813: IC1.3 50.8,66.04 52.07,67.31 52.07,78.74 | v52.07,91.44 52.07,78.74 | 52.07,78.74 66.04,78.74 SV14.1 SV14.2
  pour Top: 19.05,100.33 83.82,100.33 83.82,95.25 82.55,95.25 82.55,90.17 35.56,90.17 35.56,69.85 20.32,69.85 20.32,76.2 19.05,77.47
MCLR  (2 unrouted)
N$1
  Bottom 0.813: R1.2 D1.A
N$2
  Bottom 0.406: PE.3 26.68,19.06 26.67,19.05 26.68,19.04 PE.2 PE.1 | PE.1 | PE.1
N$3  (via drill 4.06 pad 6.45)
  Bottom 0.813: R1.1 X1.1 2.54,50.8 1.27,52.07 1.27,87.63 6.64,93 v11,93
N$4
  Bottom 0.813: U$1.22 U$1.23 7.62,81.28 15.24,73.66 C11.2 | C2.+ C11.2 | C11.2 29.21,63.5 30.48,62.23 D1.C D2.C
N$5  (5 unrouted)
N$6
  Bottom 0.406: PE.9 29.22,17.79 29.21,17.78 29.22,17.77 PE.8 29.22,15.25 | PE.7 29.22,15.25 | 29.22,15.25 29.21,15.24
N$7  (via drill 4.06 pad 6.45)
  Bottom 0.813: v5,7 1.89,7 1.27,7.62 1.27,46.99 2.54,48.26 X1.2
  pour Bottom: 0,40.64 0,100.33 16.51,100.33 16.51,76.2 17.78,74.93 17.78,67.31 34.29,67.31 34.29,40.64
  pour Top: 0,100.33 0,40.64 34.29,40.64 34.29,67.31 17.78,67.31 17.78,74.93 16.51,76.2 16.51,100.33
N$8
  Top 0.406: PE.14 34.03,18.04 35.56,16.51 R6.1
N$9
  Bottom 0.406: PE.15 31.76,24.12 33.02,22.86 34.29,22.86 35.56,21.59 R7.2
N$12
  Top 0.813: LED1.A 35.56,92.71 34.29,93.98 R8.1
N$13
  Top 0.813: LED2.A 44.45,38.1 45.72,36.83 R9.1
N$14  (1 unrouted)
  Top 0.813: C8.2 L1.2 20.32,31.75 21.59,30.48 27.94,30.48 29.21,29.21 29.21,27.94 29.22,27.93 PE.12
  Bottom 0.813: R11.1 R10.1
N$15
  Top 0.406: PE.6 27.94,25.4 27.94,12.7 29.21,11.43 44.45,11.43 R12.1
  Top 0.813: C1.2 17.78,25.4 19.05,26.67 PE.6
  Bottom 0.813: R12.1 R13.1
PE
  pour Bottom: 0,0 0,38.1 35.56,38.1 36.83,36.83 36.83,34.29 38.1,33.02 40.64,33.02 41.91,31.75 41.91,0
  pour Top: 0,0 15.24,0 15.24,38.1 0,38.1
PORTA0  (via drill 0.6)  (1 unrouted)
  Top 0.406: v102.87,22.86 109.22,22.86 110.49,24.13 110.49,26.67 109.22,27.94 U$2.035 109.22,29.21
  Bottom 0.406: R6.2 45.72,17.78 46.99,19.05 73.66,19.05 77.47,22.86 v102.87,22.86
PORTA1  (via drill 0.6)  (1 unrouted)
  Top 0.406: v102.87,24.13 107.95,24.13 109.22,25.4 U$2.034 109.22,26.67
  Bottom 0.406: R7.1 73.66,20.32 77.47,24.13 v102.87,24.13
PORTA2  (1 unrouted)
PORTA3  (1 unrouted)
PORTA4  (1 unrouted)
PORTA5  (1 unrouted)
PORTB0  (1 unrouted)
PORTB1  (1 unrouted)
PORTB2  (1 unrouted)
PORTB3  (1 unrouted)
PORTB4  (1 unrouted)
PORTB5  (1 unrouted)
PORTB6  (2 unrouted)
PORTB7  (2 unrouted)
PORTC0  (1 unrouted)
PORTC1  (1 unrouted)
PORTC2  (1 unrouted)
PORTC3  (1 unrouted)
PORTC4  (1 unrouted)
PORTC5  (1 unrouted)
PORTC6  (1 unrouted)
PORTC7  (1 unrouted)
PORTD0  (1 unrouted)
PORTD1  (1 unrouted)
PORTD2  (1 unrouted)
PORTD3  (1 unrouted)
PORTD4  (1 unrouted)
PORTD5  (1 unrouted)
PORTD6  (1 unrouted)
PORTD7  (1 unrouted)
PORTE0  (1 unrouted)
PORTE1  (1 unrouted)
PORTE2  (1 unrouted)
PORTE3  (1 unrouted)
PORTE4  (1 unrouted)
PORTE5  (1 unrouted)
PORTE6  (1 unrouted)
PORTE7  (1 unrouted)
PORTF0  (1 unrouted)
PORTF1  (1 unrouted)
PORTF2  (1 unrouted)
PORTF3  (1 unrouted)
PORTF4  (1 unrouted)
PORTF5  (1 unrouted)
PORTF6  (1 unrouted)
PORTF7  (1 unrouted)
PORTG0  (1 unrouted)
PORTG1  (1 unrouted)
PORTG2  (1 unrouted)
PORTG3  (1 unrouted)
PORTG4  (1 unrouted)
PORTG5  (1 unrouted)
PORTG6  (1 unrouted)
PORTG7  (1 unrouted)
PORTH0  (1 unrouted)
PORTH1  (1 unrouted)
PORTH2  (1 unrouted)
PORTH3  (1 unrouted)
PORTH4  (1 unrouted)
PORTH5  (1 unrouted)
PORTH6  (1 unrouted)
PORTH7  (1 unrouted)
PORTJ0  (1 unrouted)
PORTJ1  (1 unrouted)
PORTJ2  (1 unrouted)
PORTJ3  (1 unrouted)
PORTJ4  (1 unrouted)
PORTJ5  (1 unrouted)
PORTJ6  (1 unrouted)
PORTJ7  (1 unrouted)
TPIN+
  Top 0.406: PE.4 26.68,22.85 26.67,22.86 25.4,21.59 25.4,11.43 26.67,10.16 R12.2 43.18,10.16 44.45,8.89 51.44,8.89 52.7,10.16 52.7,60.96 53.98,62.23 132.08,62.23 133.35,60.96 U$2.074
TPIN-
  Top 0.406: PE.5 24.13,22.86 24.13,6.35 25.4,5.08 R13.2 35.56,7.62 36.83,8.89 43.18,8.89 43.81,8.26 52.07,8.26 53.34,9.53 53.34,59.05 53.98,59.69 134.62,59.69 135.89,60.96 U$2.073
TPOUT+
  Top 0.406: PE.11 29.46,25.65 30.48,26.67 30.48,29.21 31.75,30.48 R10.2 41.91,30.48 44.45,33.02 46.99,33.02 50.8,36.83 50.8,66.04 52.07,67.31 76.2,67.31 77.47,66.04 124.46,66.04 125.73,67.31 125.73,68.58 127,69.85 U$2.078
TPOUT-
  Top 0.406: PE.10 30.48,22.86 34.29,22.86 35.56,24.13 R11.2 35.56,27.94 36.83,29.21 41.91,29.21 44.45,31.75 46.99,31.75 51.44,36.2 51.44,63.5 52.7,64.77 128.27,64.77 129.54,66.04 U$2.077
VDD  (via drill 0.6)
  Top 0.406: U$2.037 111.76,31.75 110.49,33.02 v102.87,33.02
  Top 0.813: L1.1 33.02,35.56 43.18,45.72 R9.2 | IC1.2 43.18,76.2 44.45,77.47 55.88,77.47 | 55.88,77.47 SV12.1 | 58.42,77.47 SV12.2 | 58.42,77.47 55.88,77.47 | v81.28,77.47 58.42,77.47 | SV2.7 SV2.9 v81.28,77.47 | SV8.1 83.82,2.54 82.55,1.27 80.01,1.27 78.74,2.54 v78.74,25.4 | v81.28,77.47 v85.09,77.47
  Bottom 0.406: U$2.029 101.85,28.96 104.14,26.67 | SV3.1 113.03,7.62 105.41,7.62 104.14,8.89 104.14,26.67 | 104.14,26.67 U$2.030 | U$2.081 124.71,67.56 125.73,68.58 128.27,68.58 129.54,69.85 U$2.076 | U$2.062 133.35,45.72 135.89,43.18
  Bottom 0.813: 81.28,43.18 v81.28,77.47 | 81.28,43.18 U$2.017 | SV10.1 118.11,93.98 116.84,92.71 116.84,77.47 | 116.84,69.85 U$2.086 116.84,74.93 | 116.84,77.47 116.84,74.93 | 116.84,74.93 129.54,74.93 | 129.54,74.93 134.62,74.93 136.14,73.41 U$2.075 139.7,63.5 140.97,62.23 140.97,43.18 | 129.54,74.93 U$2.076 | v85.09,77.47 116.84,77.47 | U$2.059 135.89,43.18 140.97,43.18 | SV1.2 R3.2 149.86,44.45 148.59,43.18 140.97,43.18 | 101.6,33.02 99.06,33.02 91.44,25.4 v78.74,25.4 78.74,41.91 80.01,43.18 81.28,43.18 | 101.6,33.02 v102.87,33.02 | 101.6,33.02 U$2.029
  pour Top: 78.74,88.9 36.83,88.9 36.83,43.18 49.53,43.18 49.53,77.47 81.28,77.47 81.28,86.36
VSS
  Top 0.813: SV13.2 63.5,74.93 64.77,76.2 69.85,76.2 71.12,74.93 SV15.1
  Bottom 0.406: U$2.085 119.63,67.56 121.92,69.85 U$2.082 | U$2.065 135.89,50.8 134.62,52.07 130.81,52.07 129.54,53.34 129.54,58.42 | U$2.036 111.76,26.67 110.49,27.94 110.49,34.29 | 104.14,34.29 110.49,34.29 | U$2.040 116.84,26.67 115.57,27.94 115.57,33.02 114.3,34.29 110.49,34.29 | S2.3 S2.4 | 158.75,63.5 S2.3 | S2.3 152.4,66.04 148.59,66.04 144.78,62.23 R5.2 | SV1.3 C7.1 | PE.13 31.49,15.5 30.48,16.51 30.48,26.67 31.75,27.94 31.76,27.93 PE.16
  Bottom 0.813: 83.82,81.28 81.28,81.28 80.01,80.01 80.01,77.47 78.74,76.2 73.66,76.2 | 73.66,76.2 71.12,76.2 SV15.1 | 73.66,76.2 SV15.2 | SV13.2 SV13.1 60.96,74.93 59.69,76.2 54.61,76.2 53.34,74.93 53.34,66.04 49.53,62.23 41.91,62.23 40.64,63.5 IC1.1 | 144.78,97.79 156.21,97.79 158.75,95.25 158.75,63.5 158.75,48.26 | 144.78,97.79 129.54,97.79 | 129.54,97.79 114.3,97.79 | 114.3,97.79 99.06,97.79 | 99.06,97.79 83.82,97.79 SV2.2 SV2.4 SV2.6 SV2.8 SV2.10 83.82,82.55 83.82,81.28 | 158.75,48.26 158.75,3.81 156.21,1.27 142.24,1.27 | 127,1.27 142.24,1.27 | 111.76,1.27 127,1.27 | 96.52,1.27 111.76,1.27 | 96.52,1.27 82.55,1.27 81.28,2.54 SV8.2 | 96.52,1.27 SV9.2 | 111.76,1.27 SV3.2 | 127,1.27 SV11.2 | 142.24,1.27 SV5.2 | 144.78,97.79 SV4.2 | 158.75,48.26 SV1.3 | 129.54,97.79 SV10.2 | 114.3,97.79 SV6.2 | 99.06,97.79 SV7.2 | U$2.015 85.09,45.72 83.82,46.99 83.82,73.66 | 119.38,63.5 U$2.085 | 118.11,62.23 119.38,63.5 | 118.11,62.23 100.33,62.23 88.9,73.66 83.82,73.66 | 118.11,58.42 129.54,58.42 U$2.072 | 118.11,62.23 118.11,58.42 | 118.11,43.18 U$2.060 | 118.11,58.42 118.11,43.18 | U$2.031 104.14,34.29 104.14,41.91 105.41,43.18 118.11,43.18 | U$2.079 127,63.5 119.38,63.5 | 83.82,81.28 83.82,73.66 | PE.16 36.57,27.68 38.1,29.21 38.1,39.37 39.37,40.64 LED2.K -.2
  Bottom 1.676: -.2 X1.3
  pour Bottom: 19.05,100.33 19.05,77.47 20.32,76.2 20.32,69.85 36.83,69.85 36.83,40.64 53.34,40.64 53.34,77.47 83.82,77.47 83.82,100.33

### Text on the board
tNames: 24V | 0V | PE